# EAGLE design GBWandR1 (EAGLE 9.6.2)
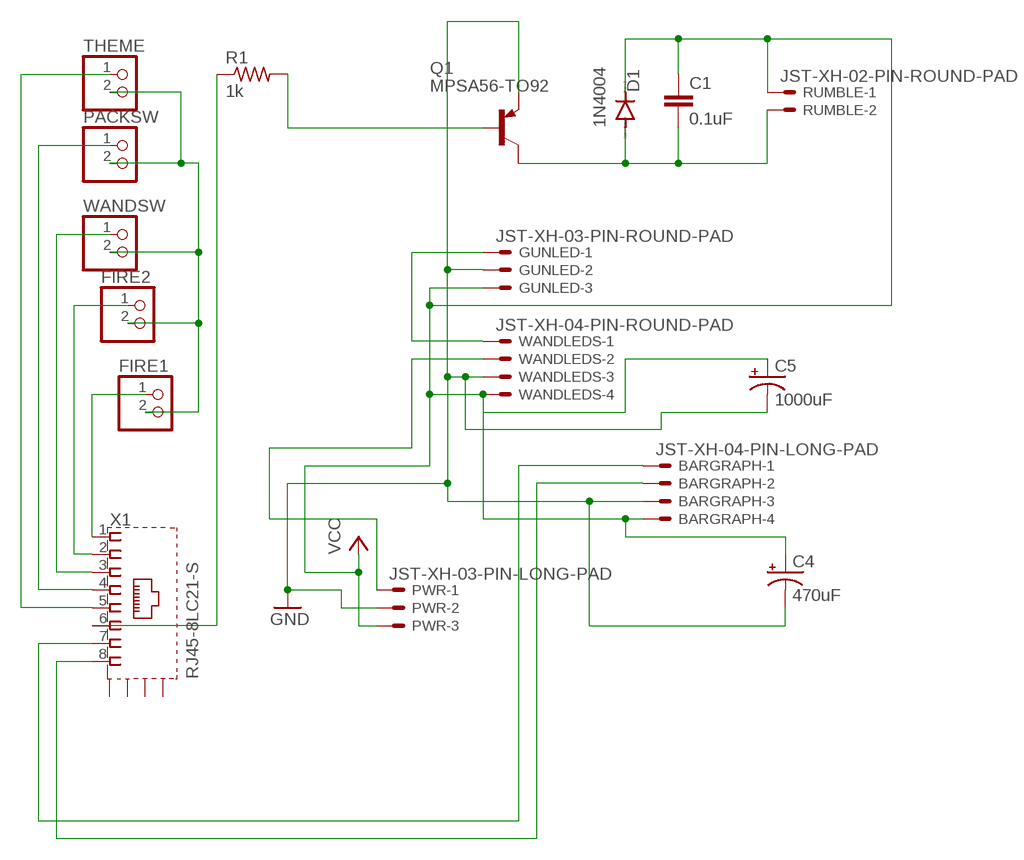
[diagram p0: schematic, sheet 1]

## Parts
BARGRAPH  JST-XH-04-PIN-LONG-PAD  [JST-XH-04-PACKAGE-LONG-PAD]
C1  0.1uF  C-EU050-024X044  [C050-024X044]
C4  470uF  CPOL-USE3.5-8  [E3,5-8]
C5  1000uF  CPOL-USE3.5-8  [E3,5-8]
D1  1N4004  [DO41-10]
FIRE1  PINHD-1X2  [1X02]
FIRE2  PINHD-1X2  [1X02]
GUNLED  JST-XH-03-PIN-ROUND-PAD  [JST-XH-03-PACKAGE-ROUND-PAD]
PACKSW  PINHD-1X2  [1X02]
PWR  JST-XH-03-PIN-LONG-PAD  [JST-XH-03-PACKAGE-LONG-PAD]
Q1  MPSA56-TO92  [TO92-CBE]
R1  1k  R-US_0207/9  [0207/9]
RUMBLE  JST-XH-02-PIN-ROUND-PAD  [JST-XH-02-PACKAGE-ROUND-PAD]
THEME  PINHD-1X2  [1X02]
WANDLEDS  JST-XH-04-PIN-ROUND-PAD  [JST-XH-04-PACKAGE-ROUND-PAD]
WANDSW  PINHD-1X2  [1X02]
X1  RJ45-8LC21-S  [RJ45-SHIELD1]

## Nets
GND: BARGRAPH.3 C4.- C5.- GUNLED.2 PWR.2 Q1.E WANDLEDS.3
N$1: PWR.1 WANDLEDS.2
N$2: FIRE1.1 X1.1
N$3: FIRE2.1 X1.2
N$4: WANDSW.1 X1.3
N$5: PACKSW.1 X1.4
N$6: THEME.1 X1.5
N$7: GUNLED.1 WANDLEDS.1
N$8: FIRE1.2 FIRE2.2 PACKSW.2 THEME.2 WANDSW.2
N$9: R1.1 X1.6
N$10: Q1.B R1.2
N$11: BARGRAPH.2 X1.8
N$14: BARGRAPH.1 X1.7
N$15: C1.2 D1.A Q1.C RUMBLE.2
VCC: BARGRAPH.4 C1.1 C4.+ C5.+ D1.C GUNLED.3 PWR.3 RUMBLE.1 WANDLEDS.4
Unconnected: X1.S1(S) X1.S2(S) X1.S3(S) X1.S4(S)

## Library data of the parts
BARGRAPH WANDLEDS = Rembrandt Electronics - JST XH Connectors v1-0:JST-XH-04-PIN: JST XH Connector 2 Pin Wire to board connector. Pitch: 2,54 mm, (0.100") Number of pins: 4 Created by Rembrandt Electronics www.rembrandtelectronics.com
C1 = rcl:C-EU: CAPACITOR, European symbol; SPICEPREFIX: C
C4 C5 = adafruit:CPOL-US: POLARIZED CAPACITOR, American symbol
D1 = diode:1N4004: DIODE general purpose rectifier, 1 A
FIRE1 FIRE2 PACKSW THEME WANDSW = pinhead:PINHD-1X2: PIN HEADER
GUNLED PWR = Rembrandt Electronics - JST XH Connectors v1-0:JST-XH-03-PIN: JST XH Connector 2 Pin Wire to board connector. Pitch: 2,54 mm, (0.100") Number of pins: 3 Created by Rembrandt Electronics www.rembrandtelectronics.com
Q1 = transistor-pnp:*-?: PNP Transistor
R1 = adafruit:R-US_: RESISTOR, American symbol
RUMBLE = Rembrandt Electronics - JST XH Connectors v1-0:JST-XH-02-PIN: JST XH Connector 2 Pin Wire to board connector. Pitch: 2,54 mm, (0.100") Number of pins: 2 Created by Rembrandt Electronics www.rembrandtelectronics.com
X1 = con-tycoelectronics:RJ45*2: RJ45 Low Profile Shield Type 2 For all RJ45 L, LC, LCT and X Series Models Source: www.tycoelectronics.com .. ENG_DS_1654001_1099_RJ_L_0507.pdf; OC_FARNELL: unknown; OC_NEWARK: unknown

## Board
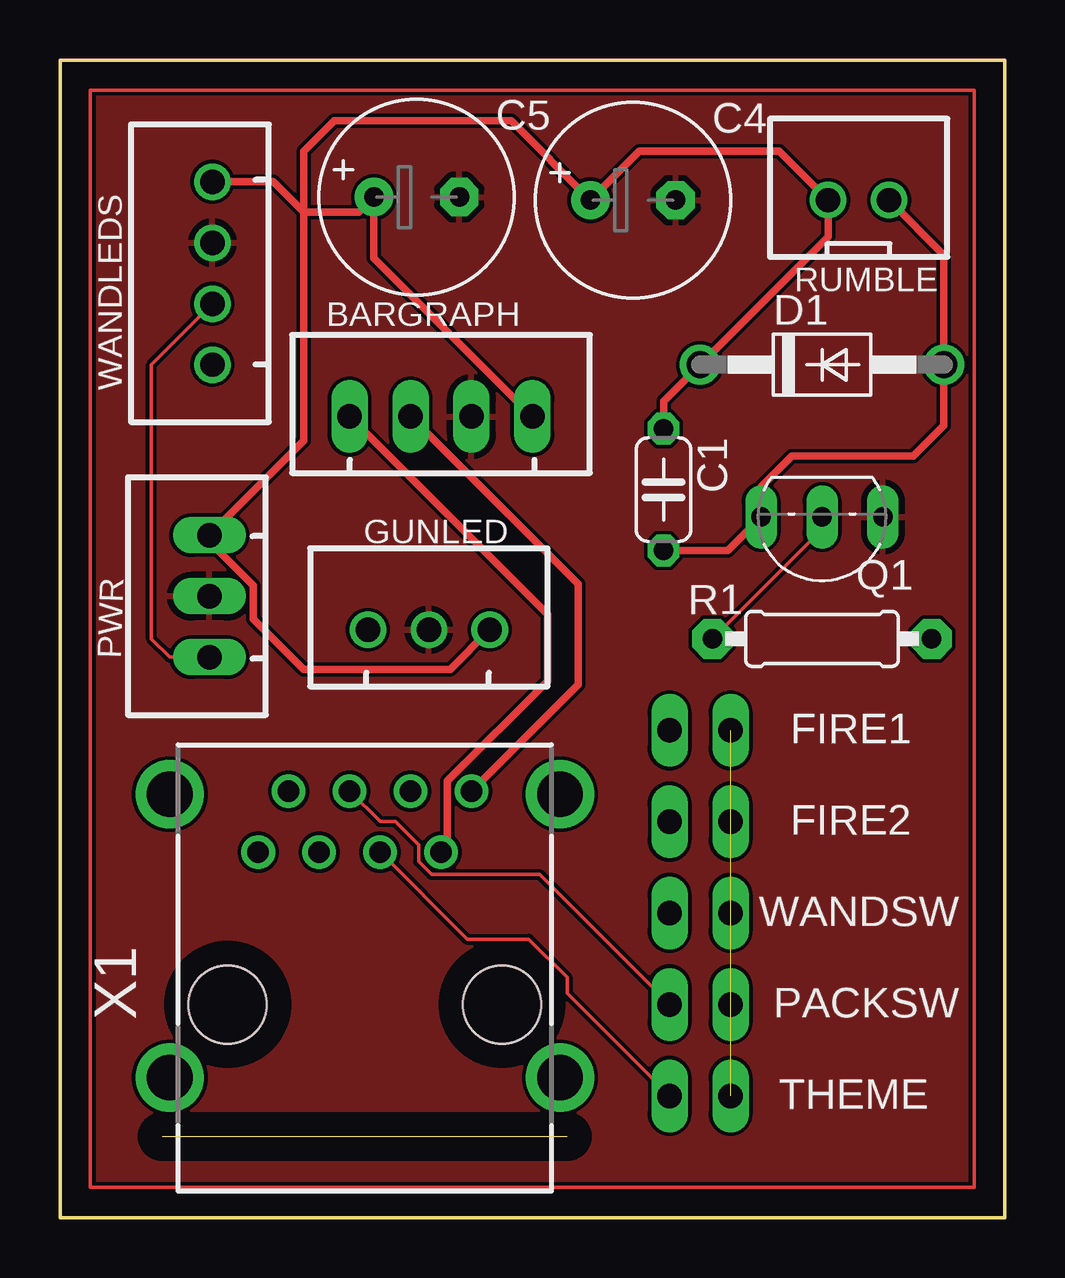
[diagram p1: board, top side]
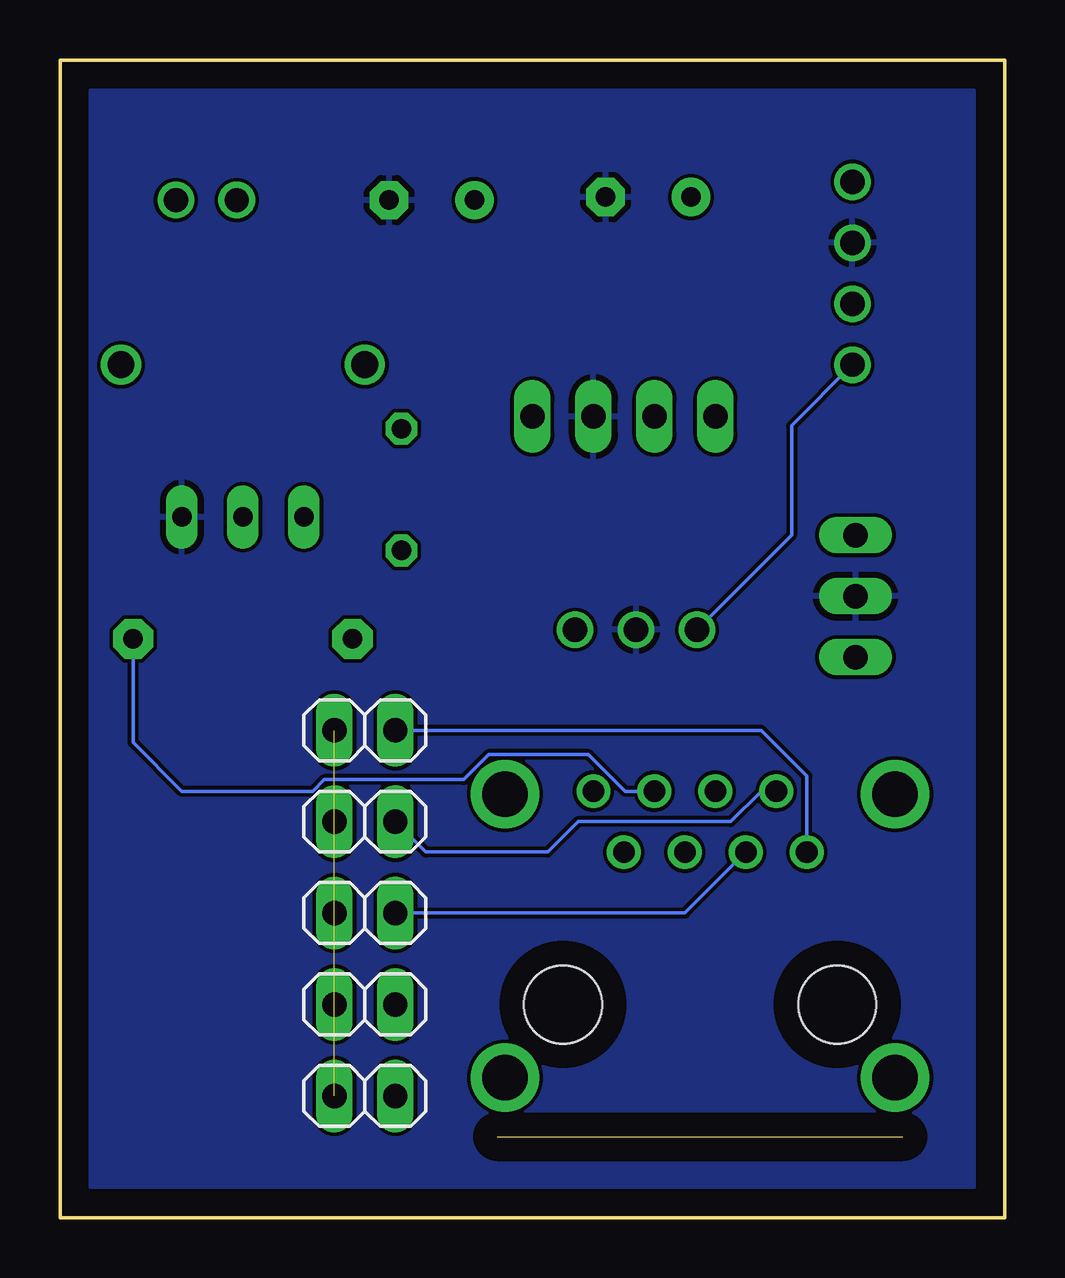
[diagram p2: board, bottom side, seen from below]

Size 39.37 x 48.26 mm. Coordinates in mm from the lower left corner, seen from the top.
Outline: 0,48.26 0,0 39.37,0 39.37,48.26 0,48.26
Copper layers (1*16): Top 0.035mm / dielectric 1.5mm / Bottom 0.035mm
Design rules "default": minimum track width 6mil, minimum drill 0.35mm, track to track 6mil, track to pad 6mil, pad to pad 6mil, via to via 6mil, smd to smd 6mil, copper to edge 40mil, drill to drill 6mil, minimum pad ring 10mil, minimum via ring 8mil, stop-mask expansion 4mil, vias tented up to drill 0mil, thermal gap 10mil

### Footprints (pad centres in the part's own frame; a part is rotated, then mirrored left to right if it is on the bottom)
JST-XH-04-PACKAGE-LONG-PAD = drill 1.016 long: 1 -3.81,0; 2 -1.27,0; 3 1.27,0; 4 3.81,0
C050-024X044 = drill 0.813 octagon: 1 -2.54,0; 2 2.54,0
E3,5-8 = drill 0.813 pad 1.6: + -1.778,0 | drill 0.813 pad 1.6 octagon: - 1.778,0
DO41-10 = drill 1.118: A 5.08,0; C -5.08,0
1X02 = drill 1.016 long: 1 -1.27,0; 2 1.27,0
JST-XH-03-PACKAGE-ROUND-PAD = drill 1.016: 1 -2.54,0; 2 0,0; 3 2.54,0
JST-XH-03-PACKAGE-LONG-PAD = drill 1.016 long: 1 -2.54,0; 2 0,0; 3 2.54,0
TO92-CBE = drill 0.813 long: B 0,0; C 2.54,0; E -2.54,0
0207/9 = drill 0.813 pad 1.676 octagon: 1 -4.572,0; 2 4.572,0
JST-XH-02-PACKAGE-ROUND-PAD = drill 1.016: 1 -1.27,0; 2 1.27,0
JST-XH-04-PACKAGE-ROUND-PAD = drill 1.016: 1 -3.81,0; 2 -1.27,0; 3 1.27,0; 4 3.81,0
RJ45-SHIELD1 = drill 0.9 pad 1.4: 1 -4.445,6.35; 2 -3.175,8.89; 3 -1.905,6.35; 4 -0.635,8.89; 5 0.635,6.35; 6 1.905,8.89; 7 3.175,6.35; 8 4.445,8.89 | drill 1.9 pad 2.5: S1 -8.128,-3.048; S2 8.128,-3.048; S3 -8.128,8.76; S4 8.128,8.76 | hole 3.251: -5.715,0; 5.715,0

### Placement (x,y rotation side)
BARGRAPH  15.88,33.4 0 top
C1  25.15,30.35 270 top
C4  23.88,42.42 0 top
C5  14.86,42.55 0 top
D1  31.75,35.56 0 top
FIRE1  26.67,20.32 180 bottom
FIRE2  26.67,16.51 180 bottom
GUNLED  15.37,24.51 0 top
PACKSW  26.67,8.89 180 bottom
PWR  6.22,25.91 90 top
Q1  31.75,29.21 180 top
R1  31.75,24.13 180 top
RUMBLE  33.27,42.42 0 top
THEME  26.67,5.08 180 bottom
WANDLEDS  6.35,39.37 90 top
WANDSW  26.67,12.7 180 bottom
X1  12.7,8.89 0 top

### Tracks (layer width: path | path; a pad name or v marks a point on that pad's centre or on a via)
GND
  pour Top: 1.27,46.99 38.1,46.99 38.1,1.27 1.27,1.27
  pour Bottom: 1.27,46.99 38.1,46.99 38.1,1.27 1.27,1.27
N$1
  Top 0.152: PWR.1 4.57,23.37 3.81,24.13 3.81,35.56 WANDLEDS.2
N$2
  Bottom 0.152: X1.1 8.26,18.42 10.16,20.32 FIRE1.1
N$3
  Bottom 0.152: X1.2 10.16,17.78 11.43,16.51 17.78,16.51 19.05,15.24 24.13,15.24 FIRE2.1
N$4
  Bottom 0.152: X1.3 13.33,12.7 WANDSW.1
N$5
  Top 0.152: X1.4 13.33,16.51 13.97,16.51 14.94,15.54 14.94,14.85 15.49,14.31 19.05,14.31 19.98,14.31 PACKSW.1
N$6
  Top 0.152: X1.5 16.97,11.61 19.54,11.61 21.13,10.02 21.13,9.35 THEME.1
N$7
  Bottom 0.152: WANDLEDS.1 8.89,33.02 8.89,28.45 GUNLED.1
N$8  (4 unrouted)
N$9
  Bottom 0.152: X1.6 15.83,17.78 17.35,19.3 21.51,19.3 22.55,18.26 28.35,18.26 28.83,17.78 34.29,17.78 36.32,19.81 R1.1
N$10
  Top 0.152: R1.2 31.75,28.7 Q1.B
N$11
  Top 0.305: BARGRAPH.2 21.59,26.42 21.59,22.22 X1.8
N$14
  Top 0.305: BARGRAPH.1 20.32,25.15 20.32,24.13 20.32,22.38 16.14,18.2 16.14,15.5 X1.7
N$15
  Top 0.152: 36.83,37.85 D1.A
  Top 0.305: RUMBLE.2 36.83,40.13 D1.A 36.83,33.02 35.56,31.75 30.48,31.75 29.21,30.48 Q1.C 27.81,27.81 C1.2
S$1
  Top 0.152: 1.27,1.27 38.1,1.27 38.1,46.99 1.27,46.99 1.27,1.27
VCC
  Top 0.305: C1.1 25.15,33.02 25.15,34.04 D1.C 32,40.89 RUMBLE.1 29.97,44.45 24.13,44.45 C4.+ 18.8,45.72 11.43,45.72 10.16,44.45 10.16,41.91 | BARGRAPH.4 13.08,40 C5.+ 12.45,41.91 10.16,41.91 | 10.16,41.91 10.16,32.39 PWR.3 6.22,28.18 8.05,26.35 8.05,24.97 10.16,22.86 16.26,22.86 GUNLED.3 | WANDLEDS.4 8.89,43.18 10.16,41.91